# Altium schematic sheet MK66F.SchDoc
size A3
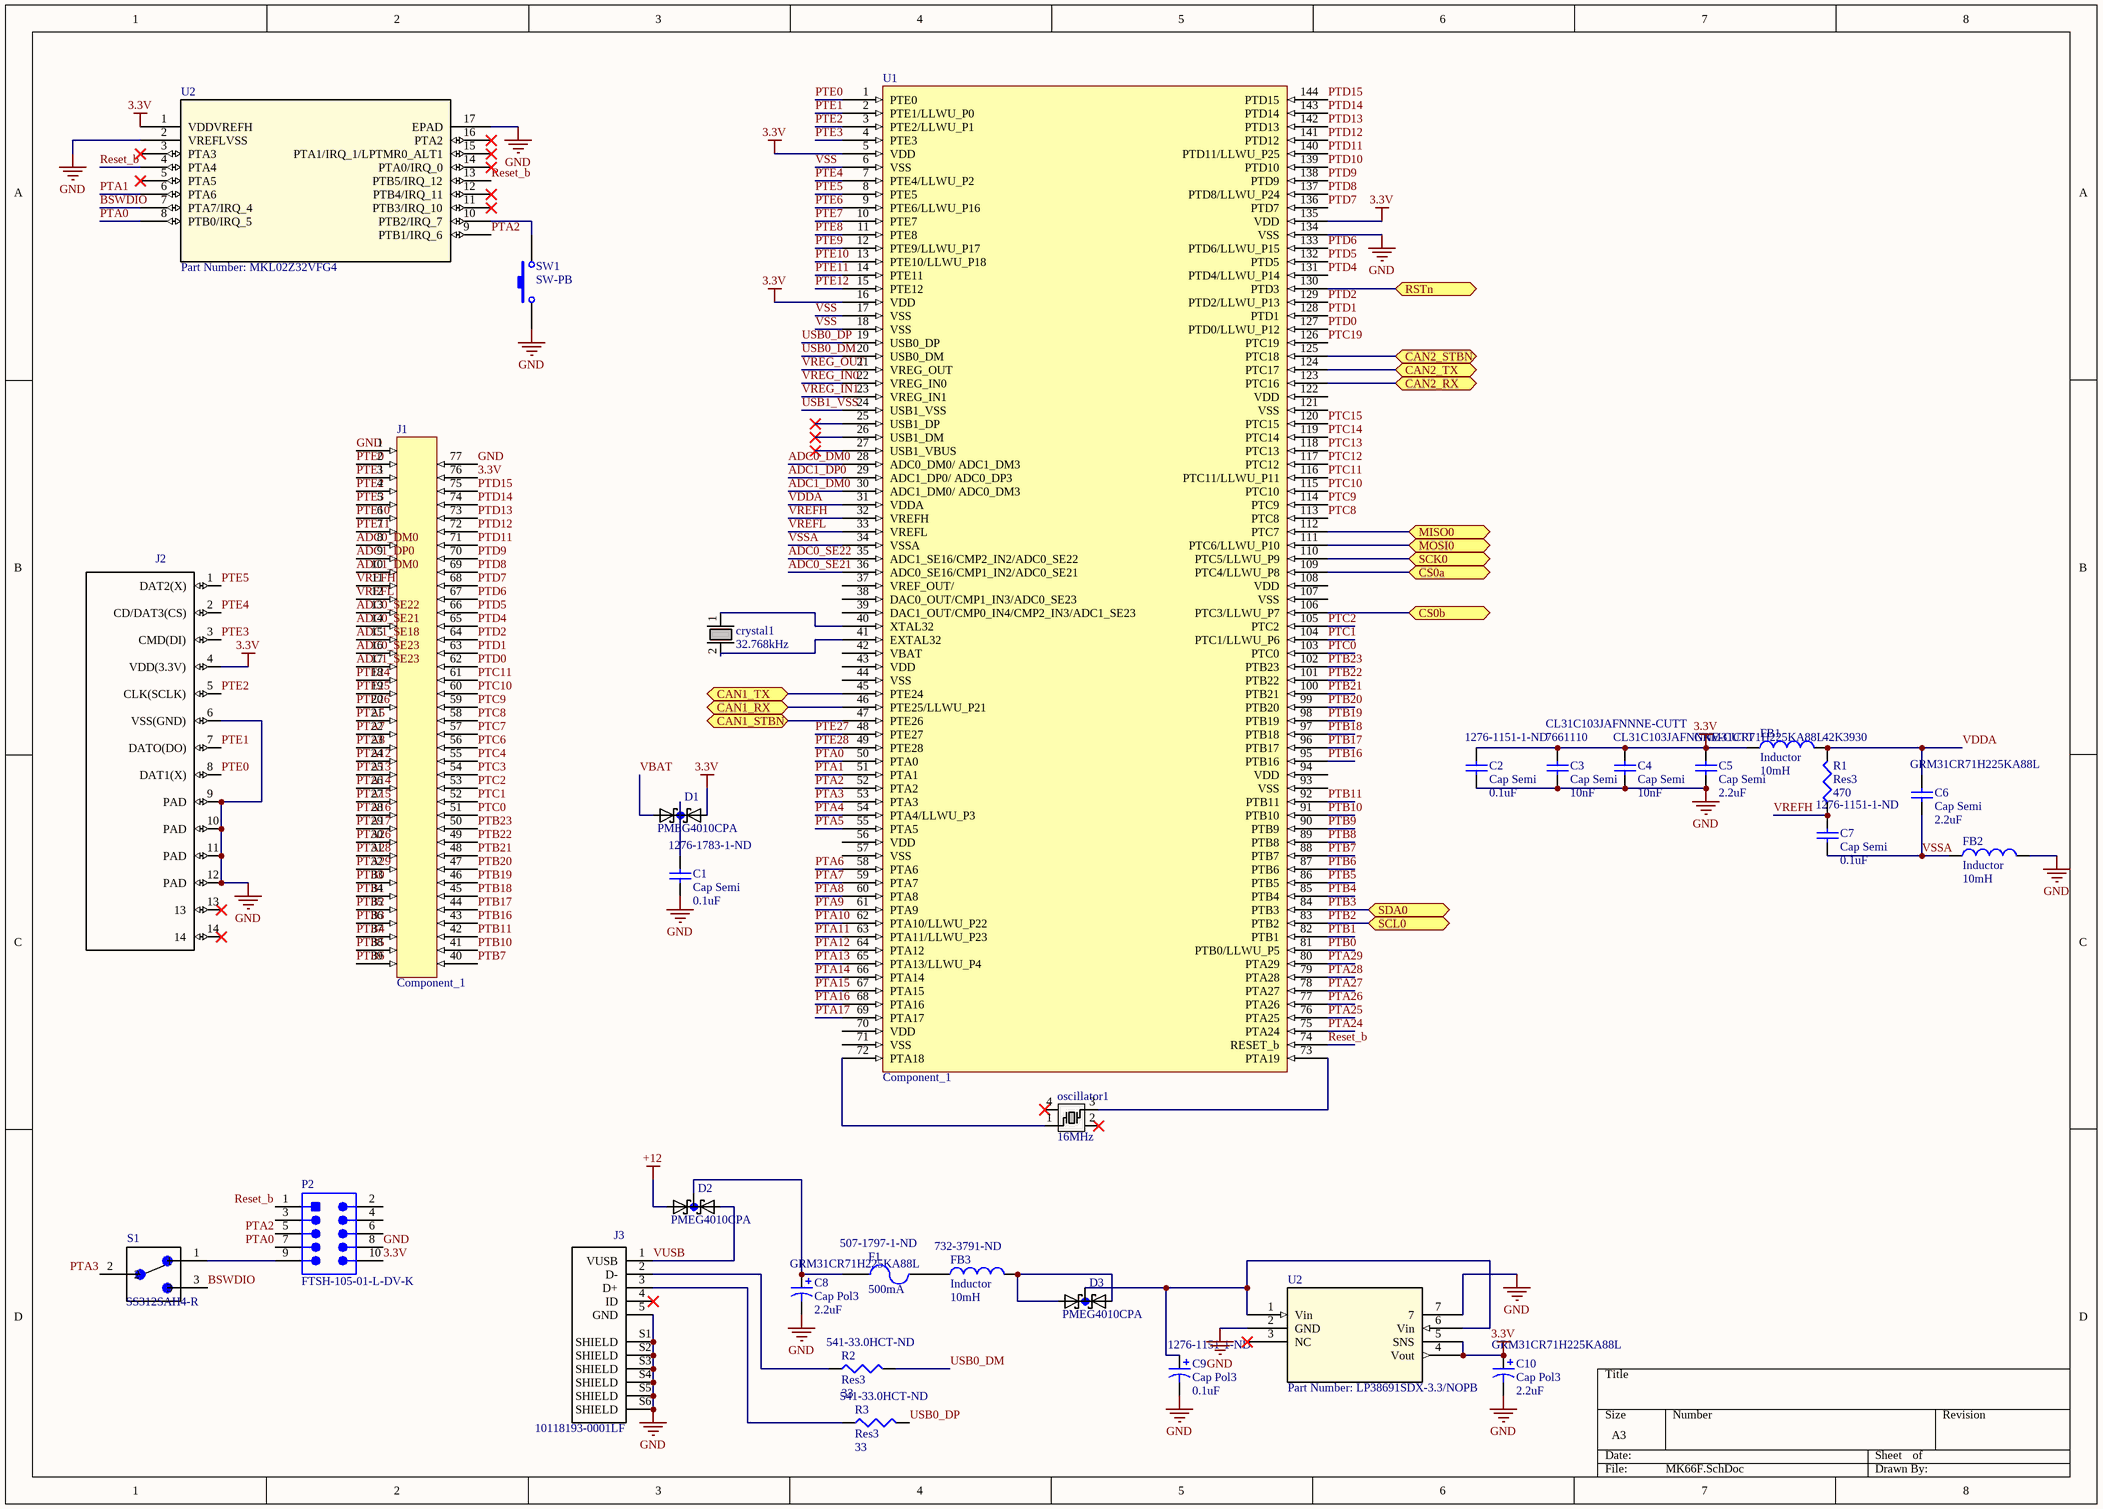
[diagram p0: MK66F.SchDoc]

## Parts
(Parts that share a designator on the sheet are numbered #1, #2 ... from top to bottom, then left to right.)
C1  Cap Semi  value 0.1uF  Supplier Part Number 1: 1276-1783-1-ND  [C1206]
C2  Cap Semi  value 0.1uF  Supplier Part Number 1: 1276-1151-1-ND  [C1206]
C3  Cap Semi  value 10nF  Supplier Part Number 1: 7661110  Supplier Part Number 2: CL31C103JAFNNNE-CUTT  [C1206]
C4  Cap Semi  value 10nF  Supplier Part Number 1: CL31C103JAFNNNE-CUTT  [C1206]
C5  Cap Semi  value 2.2uF  Supplier Part Number 1: GRM31CR71H225KA88L  [C1206]
C6  Cap Semi  value 2.2uF  Supplier Part Number 1: GRM31CR71H225KA88L  [C1206]
C7  Cap Semi  value 0.1uF  Supplier Part Number 1: 1276-1151-1-ND  [C1206]
C8  Cap Pol3  value 2.2uF  Supplier Part Number 1: GRM31CR71H225KA88L  [C1206]
C9  Cap Pol3  value 0.1uF  Supplier Part Number 1: 1276-1151-1-ND  [C1206]
C10  Cap Pol3  value 2.2uF  Supplier Part Number 1: GRM31CR71H225KA88L  [C1206]
crystal1  value 32.768kHz  [ECS-.327-CDX-1128]  (hidden comment: SMD_Crystal)
D1  PMEG4010CPA  [*SOT1061]
D2  PMEG4010CPA  [*SOT1061]
D3  PMEG4010CPA  [*SOT1061]
F1  500mA  Supplier Part Number 1: 507-1797-1-ND  [RESC3216X125N]
FB1  Inductor  value 10mH  [J1-0603]
FB2  Inductor  value 10mH  [J1-0603]
FB3  Inductor  value 10mH  Supplier Part Number 1: 732-3791-ND  [J1-0603]
J1  Component_1  [SPGA48x11 - duplicate]
J2  1140084168  [*1140084168]  (value not drawn)
J3  10118193-0001LF  [FCI_10118193-0001LF_10118193-0001LF(Primary)]
oscillator1  value 16MHz  [ECS-160-8-30B-CKM]  (hidden comment: SMD_oscillator)
P2  FTSH-105-01-L-DV-K  [SMTC-FTSH-105-01-L-DV-K_V]
R1  Res3  value 470  Supplier Part Number 1: 42K3930  [J1-0603]
R2  Res3  value 33  Supplier Part Number 1: 541-33.0HCT-ND  [J1-0603]
R3  Res3  value 33  Supplier Part Number 1: 541-33.0HCT-ND  [J1-0603]
S1  SS312SAH4-R  [*SW_SS312SAH4-R]
SW1  SW-PB  [P13348SCT-ND]
U1  Component_1  [98ASS23177W]
U2#1  Part Number: MKL02Z32VFG4  [QFN-16_3X3X0.65]
U2#2  Part Number: LP38691SDX-3.3/NOPB  [SDE06A]

## Ports
CAN1_RX (bidir), CAN1_STBN (bidir), CAN1_TX (bidir), CAN2_RX (bidir), CAN2_STBN (bidir), CAN2_TX (bidir), CS0a (bidir), CS0b (bidir), MISO0 (bidir), MOSI0 (bidir), RSTn (bidir), SCK0 (bidir), SCL0 (bidir), SDA0 (bidir)

## Nets
3.3V: C2.2 C3.2 C4.2 C5.2 C10.1 D1.2(A2) FB1.1 J1.76 J2.4(VDD(3.3V)) P2.10 U1.5(VDD) U1.16(VDD) U1.135(VDD) U2#1.1(VDDVREFH) U2#2.4(Vout) U2#2.5(SNS)
+12: D2.1(A1)
GND: C1.1 C2.1 C3.1 C4.1 C5.1 C8.2 C9.2 C10.2 FB2.2 J1.1 J1.77 J2.6(VSS(GND)) J2.9(PAD) J2.10(PAD) J2.11(PAD) J2.12(PAD) J3.5(GND) J3.S1(SHIELD) J3.S2(SHIELD) J3.S3(SHIELD) J3.S4(SHIELD) J3.S5(SHIELD) J3.S6(SHIELD) P2.8 SW1.1 U1.134(VSS) U2#1.2(VREFLVSS) U2#1.17(EPAD) U2#2.2(GND) U2#2.7
ADC0_DM0: J1.8 U1.28(ADC0_DM0/_ADC1_DM3)
ADC0_SE21: J1.14 U1.36(ADC0_SE16/CMP1_IN2/ADC0_SE21)
ADC0_SE22: J1.13 U1.35(ADC1_SE16/CMP2_IN2/ADC0_SE22)
ADC0_SE23: J1.16
ADC1_DM0: J1.10 U1.30(ADC1_DM0/_ADC0_DM3)
ADC1_DP0: J1.9 U1.29(ADC1_DP0/_ADC0_DP3)
ADC1_SE18: J1.15
ADC1_SE23: J1.17
BSWDIO: S1.3 U2#1.7(PTA7/IRQ_4)
CAN1_RX: U1.46(PTE25/LLWU_P21) ; port CAN1_RX
CAN1_STBN: U1.47(PTE26) ; port CAN1_STBN
CAN1_TX: U1.45(PTE24) ; port CAN1_TX
CAN2_RX: U1.123(PTC16) ; port CAN2_RX
CAN2_STBN: U1.125(PTC18) ; port CAN2_STBN
CAN2_TX: U1.124(PTC17) ; port CAN2_TX
CS0a: U1.109(PTC4/LLWU_P8) ; port CS0a
CS0b: U1.106(PTC3/LLWU_P7) ; port CS0b
MISO0: U1.112(PTC7) ; port MISO0
MOSI0: U1.111(PTC6/LLWU_P10) ; port MOSI0
PTA0: P2.7 U1.50(PTA0) U2#1.8(PTB0/IRQ_5)
PTA1: U1.51(PTA1) U2#1.6(PTA6)
PTA2: P2.5 U1.52(PTA2) U2#1.9(PTB1/IRQ_6)
PTA3: S1.2 U1.53(PTA3)
PTA4: U1.54(PTA4/LLWU_P3)
PTA5: J1.21 U1.55(PTA5)
PTA6: U1.58(PTA6)
PTA7: J1.22 U1.59(PTA7)
PTA8: J1.23 U1.60(PTA8)
PTA9: U1.61(PTA9)
PTA10: U1.62(PTA10/LLWU_P22)
PTA11: U1.63(PTA11/LLWU_P23)
PTA12: J1.24 U1.64(PTA12)
PTA13: J1.25 U1.65(PTA13/LLWU_P4)
PTA14: J1.26 U1.66(PTA14)
PTA15: J1.27 U1.67(PTA15)
PTA16: J1.28 U1.68(PTA16)
PTA17: J1.29 U1.69(PTA17)
PTA24: U1.75(PTA24)
PTA25: U1.76(PTA25)
PTA26: J1.30 U1.77(PTA26)
PTA27: U1.78(PTA27)
PTA28: J1.31 U1.79(PTA28)
PTA29: J1.32 U1.80(PTA29)
PTB0: J1.33 U1.81(PTB0/LLWU_P5)
PTB1: J1.34 U1.82(PTB1)
PTB2: J1.35 U1.83(PTB2) ; port SCL0
PTB3: J1.36 U1.84(PTB3) ; port SDA0
PTB4: J1.37 U1.85(PTB4)
PTB5: J1.38 U1.86(PTB5)
PTB6: J1.39 U1.87(PTB6)
PTB7: J1.40 U1.88(PTB7)
PTB8: U1.89(PTB8)
PTB9: U1.90(PTB9)
PTB10: J1.41 U1.91(PTB10)
PTB11: J1.42 U1.92(PTB11)
PTB16: J1.43 U1.95(PTB16)
PTB17: J1.44 U1.96(PTB17)
PTB18: J1.45 U1.97(PTB18)
PTB19: J1.46 U1.98(PTB19)
PTB20: J1.47 U1.99(PTB20)
PTB21: J1.48 U1.100(PTB21)
PTB22: J1.49 U1.101(PTB22)
PTB23: J1.50 U1.102(PTB23)
PTC0: J1.51 U1.103(PTC0)
PTC1: J1.52 U1.104(PTC1/LLWU_P6)
PTC2: J1.53 U1.105(PTC2)
PTC3: J1.54
PTC4: J1.55
PTC6: J1.56
PTC7: J1.57
PTC8: J1.58 U1.113(PTC8)
PTC9: J1.59 U1.114(PTC9)
PTC10: J1.60 U1.115(PTC10)
PTC11: J1.61 U1.116(PTC11/LLWU_P11)
PTC12: U1.117(PTC12)
PTC13: U1.118(PTC13)
PTC14: U1.119(PTC14)
PTC15: U1.120(PTC15)
PTC19: U1.126(PTC19)
PTD0: J1.62 U1.127(PTD0/LLWU_P12)
PTD1: J1.63 U1.128(PTD1)
PTD2: J1.64 U1.129(PTD2/LLWU_P13)
PTD4: J1.65 U1.131(PTD4/LLWU_P14)
PTD5: J1.66 U1.132(PTD5)
PTD6: J1.67 U1.133(PTD6/LLWU_P15)
PTD7: J1.68 U1.136(PTD7)
PTD8: J1.69 U1.137(PTD8/LLWU_P24)
PTD9: J1.70 U1.138(PTD9)
PTD10: U1.139(PTD10)
PTD11: J1.71 U1.140(PTD11/LLWU_P25)
PTD12: J1.72 U1.141(PTD12)
PTD13: J1.73 U1.142(PTD13)
PTD14: J1.74 U1.143(PTD14)
PTD15: J1.75 U1.144(PTD15)
PTE0: J1.2 J2.8(DAT1(X)) U1.1(PTE0)
PTE1: J1.3 J2.7(DATO(DO)) U1.2(PTE1/LLWU_P0)
PTE2: J1.4 J2.5(CLK(SCLK)) U1.3(PTE2/LLWU_P1)
PTE3: J1.5 J2.3(CMD(DI)) U1.4(PTE3)
PTE4: J2.2(CD/DAT3(CS)) U1.7(PTE4/LLWU_P2)
PTE5: J2.1(DAT2(X)) U1.8(PTE5)
PTE6: U1.9(PTE6/LLWU_P16)
PTE7: U1.10(PTE7)
PTE8: U1.11(PTE8)
PTE9: U1.12(PTE9/LLWU_P17)
PTE10: J1.6 U1.13(PTE10/LLWU_P18)
PTE11: J1.7 U1.14(PTE11)
PTE12: U1.15(PTE12)
PTE24: J1.18
PTE25: J1.19
PTE26: J1.20
PTE27: U1.48(PTE27)
PTE28: U1.49(PTE28)
Reset_b: P2.1 U1.74(RESET_b) U2#1.4(PTA4) U2#1.13(PTB5/IRQ_12)
RSTn: U1.130(PTD3) ; port RSTn
SCK0: U1.110(PTC5/LLWU_P9) ; port SCK0
USB0_DM: R2.2 U1.20(USB0_DM)
USB0_DP: R3.2 U1.19(USB0_DP)
USB1_VSS: U1.24(USB1_VSS)
VBAT: D1.1(A1)
VDDA: C6.2 FB1.2 R1.2 U1.31(VDDA)
VREFH: C7.2 J1.11 R1.1 U1.32(VREFH)
VREFL: J1.12 U1.33(VREFL)
VREG_IN0: U1.22(VREG_IN0)
VREG_IN1: U1.23(VREG_IN1)
VREG_OUT: U1.21(VREG_OUT)
VSS: U1.6(VSS) U1.17(VSS) U1.18(VSS)
VSSA: C6.1 C7.1 FB2.1 U1.34(VSSA)
VUSB: D2.2(A2) J3.1(VUSB)
NetC1_2: C1.2 D1.3(K1K2)
NetC8_1: C8.1 D2.3(K1K2) F1.1
NetC9_1: C9.1 D3.3(K1K2) U2#2.1(Vin) U2#2.6(Vin)
Netcrystal1_1: crystal1.1 U1.40(XTAL32)
Netcrystal1_2: crystal1.2 U1.41(EXTAL32)
NetD3_1: D3.1(A1) D3.2(A2) FB3.2
NetF1_2: F1.2 FB3.1
NetJ3_2: J3.2(D-) R2.1
NetJ3_3: J3.3(D+) R3.1
Netoscillator1_1: oscillator1.1 U1.72(PTA18)
Netoscillator1_3: oscillator1.3 U1.73(PTA19)
NetP2_9: P2.9 S1.1
NetSW1_2: SW1.2 U2#1.10(PTB2/IRQ_7)

Not connected (* = marked no-connect by the designer): J2 13* 14*; J3 4(ID)*; oscillator1 2* 4*; P2 2 3 4 6; U1 25(USB1_DP)* 26(USB1_DM)* 27(USB1_VBUS)* 37(VREF_OUT/) 38(DAC0_OUT/CMP1_IN3/ADC0_SE23) 39(DAC1_OUT/CMP0_IN4/CMP2_IN3/ADC1_SE23) 42(VBAT) 43(VDD) 44(VSS) 56(VDD) 57(VSS) 70(VDD) 71(VSS) 93(VSS) 94(VDD) 107(VSS) 108(VDD) 121(VSS) 122(VDD); U2#1 3(PTA3)* 5(PTA5)* 11(PTB3/IRQ_10)* 12(PTB4/IRQ_11)* 14(PTA0/IRQ_0)* 15(PTA1/IRQ_1/LPTMR0_ALT1)* 16(PTA2)*; U2#2 3(NC)*

## Library data of the parts
C1 = Cap Semi: SAMSUNG ELECTRO-MECHANICS - CL31B105KOFNNNE - SMD Multilayer Ceramic Capacitor, 1 µF, 16 V, 1206 [3216 Metric], ± 10%, X7R, CL Series; SPN: 1276-1017-1-ND; Capacitance: 1uF; Voltage Rating: 16V; Published: 8-Jun-2000; LatestRevisionDate: 29-May-2009; LatestRevisionNote: IPC-7351 Footprint Added.; PackageReference: C1206; Publisher: Altium Limited; PackageDescription: Chip Capacitor; Supplier 1: Digi-Key; Manufacturer: Samsung; Manufacturer Part Number: CL31B105KOFNNNE; RoHS: Yes; Category: Ceramic Capacitors; Stock 1: 71092; Pricing 1: 1=0.16000, 10=0.11100, 50=0.06320, 100=0.05230, 500=0.03668, 1000=0.03036 (USD); Mount: Surface Mount; Case/Package: 1206; Case Code (Metric): 3216; Case Code (Imperial): 1206; Contact Plating: Tin; Material: Ceramic; Min Operating Temperature: -55°C; Max Operating Temperature: 125°C; Tolerance: 10%; Packaging: Tape and Reel; Package Quantity: 1; Dielectric: X7R; Voltage Rating (DC): 16V; Voltage: 16V; Length: 3.2mm; Height: 1.25mm; Depth: 1.6mm; Width: 0.063inch; Thickness: 0.055inch; Radiation Hardening: No; Lead Free: Lead Free; ComponentLink1URL: https://datasheet.ciiva.com/25798/cl31b105kofnnne-25798673.pdf?src-supplier=Digi-Key; ComponentLink1Description: https://datasheet.ciiva.com/25798/cl31b105kofnnne-25798673.pdf?src-supplier=Digi-Key; ComponentLink2URL: https://datasheet.ciiva.com/26838/getdatasheetpartid-358370-26838906.pdf?src-supplier=Verical; ComponentLink2Description: https://datasheet.ciiva.com/26838/getdatasheetpartid-358370-26838906.pdf?src-supplier=Verical; ComponentLink3URL: https://datasheet.ciiva.com/29200/453334-da-01-en-vs-kondensator-1206-29200316.pdf?src-supplier=Conrad; ComponentLink3Description: https://datasheet.ciiva.com/29200/453334-da-01-en-vs-kondensator-1206-29200316.pdf?src-supplier=Conrad; ComponentLink4URL: https://datasheet.ciiva.com/26310/mlcc-catalogdownload2013-eng-26310089.pdf?src-supplier=Distrelec; ComponentLink4Description: https://datasheet.ciiva.com/26310/mlcc-catalogdownload2013-eng-26310089.pdf?src-supplier=Distrelec
C2 C7 = Cap Semi: CAP CER 0.1UF 100V X7R 1206; Manufacturer: Samsung; Manufacturer Part Number: CL31B104KCFNNNE; SPN: 1276-1017-1-ND; Material: Ceramic; Tolerance: 10%; Capacitance: 100nF; Published: 8-Jun-2000; LatestRevisionDate: 29-May-2009; LatestRevisionNote: IPC-7351 Footprint Added.; PackageReference: C1206; Publisher: Altium Limited; PackageDescription: Chip Capacitor; Supplier 1: Digi-Key; RoHS: Yes; Category: Ceramic Capacitors; Stock 1: 57431; Pricing 1: 1=0.14000, 10=0.09900, 50=0.05600, 100=0.04650, 500=0.03258, 1000=0.02697 (USD); Mount: Surface Mount; Case/Package: 1206; Case Code (Metric): 3216; Case Code (Imperial): 1206; Contact Plating: Tin; Min Operating Temperature: -55°C; Max Operating Temperature: 125°C; Packaging: Tape and Reel; Dielectric: X7R; Voltage Rating: 100V; Package Quantity: 1; Voltage Rating (DC): 100V; Voltage: 100V; Length: 3.2mm; Height: 1.25mm; Width: 0.063inch; Depth: 1.6mm; Thickness: 0.055inch; Radiation Hardening: No; Lead Free: Lead Free; ComponentLink1URL: https://datasheet.ciiva.com/16199/cl31b104kcfnnne-16199426.pdf?src-supplier=Future+Electronics; ComponentLink1Description: https://datasheet.ciiva.com/16199/cl31b104kcfnnne-16199426.pdf?src-supplier=Future+Electronics; ComponentLink2URL: https://datasheet.ciiva.com/25794/cl31b104kcfnnne-25794789.pdf?src-supplier=Digi-Key; ComponentLink2Description: https://datasheet.ciiva.com/25794/cl31b104kcfnnne-25794789.pdf?src-supplier=Digi-Key; ComponentLink3URL: https://datasheet.ciiva.com/26838/getdatasheetpartid-358426-26838891.pdf?src-supplier=Verical; ComponentLink3Description: https://datasheet.ciiva.com/26838/getdatasheetpartid-358426-26838891.pdf?src-supplier=Verical; ComponentLink4URL: https://datasheet.ciiva.com/29201/451915-da-01-en-vs-kondensator-1206-29201844.pdf?src-supplier=Conrad; ComponentLink4Description: https://datasheet.ciiva.com/29201/451915-da-01-en-vs-kondensator-1206-29201844.pdf?src-supplier=Conrad; ComponentLink5URL: https://datasheet.ciiva.com/26310/mlcc-catalogdownload2013-eng-26310106.pdf?src-supplier=Distrelec; ComponentLink5Description: https://datasheet.ciiva.com/26310/mlcc-catalogdownload2013-eng-26310106.pdf?src-supplier=Distrelec
C3 = Cap Semi: CL31 Series 1206 0.01 uF 25 V 5 % COG SMT Multilayer Ceramic Capacitor; Manufacturer: Samsung; Manufacturer Part Number: CL31C102FBCNNNL; SPN: 1276-2735-1-ND; Description: Cap Ceramic 0.001uF 50V C0G 1% SMD 1206 125C Cardboard T/R; Tolerance: 1%; Capacitance: 1nF; Voltage Rating: 50V; Dielectric: C0G; Temperature Coefficient: 300ppm/°C; Published: 8-Jun-2000; LatestRevisionDate: 29-May-2009; LatestRevisionNote: IPC-7351 Footprint Added.; PackageReference: C1206; Publisher: Altium Limited; PackageDescription: Chip Capacitor; Supplier 1: RSComponents; RoHS: Yes; Category: Ceramic Capacitors; Stock 1: 100; Pricing 1: 50=0.15100, 250=0.13600, 500=0.12700, 2500=0.12000, 5000=0.11400 (USD); Mount: Surface Mount; Case/Package: 1206; Min Operating Temperature: -55°C; Max Operating Temperature: 125°C; Packaging: Tape and Reel; Voltage Rating (DC): 50V; Package Quantity: 15000; Voltage: 50V; Length: 3.2mm; Height: 0.85mm; Width: 0.063inch; Thickness: 0.039inch; Depth: 1.6mm; Radiation Hardening: No; ComponentLink1URL: https://datasheet.ciiva.com/25728/cl31c102fbcnnnl-25728280.pdf?src-supplier=Digi-Key; ComponentLink1Description: https://datasheet.ciiva.com/25728/cl31c102fbcnnnl-25728280.pdf?src-supplier=Digi-Key; Supplier 2: Future Electronics; Stock 2: 42000; Pricing 2: 1=0.09150, 50=0.06980, 100=0.06650, 250=0.06240, 500=0.05950 (USD); Case Code (Imperial): 1206; Case Code (Metric): 3216; Lead Free: Lead Free; ComponentLink2URL: https://datasheet.ciiva.com/15196/getdatasheetpartid-355227-15196083.pdf?src-supplier=Verical; ComponentLink2Description: https://datasheet.ciiva.com/15196/getdatasheetpartid-355227-15196083.pdf?src-supplier=Verical; ComponentLink3URL: https://datasheet.ciiva.com/16426/cl31c103jafnnne-16426415.pdf?src-supplier=Future+Electronics; ComponentLink3Description: https://datasheet.ciiva.com/16426/cl31c103jafnnne-16426415.pdf?src-supplier=Future+Electronics
C4 = Cap Semi: CL31 Series 1206 0.01 uF 25 V 5 % COG SMT Multilayer Ceramic Capacitor; Manufacturer: Samsung; Manufacturer Part Number: CL31C103JAFNNNE; SPN: 1276-2735-1-ND; Tolerance: 5%; Voltage Rating: 25V; Dielectric: C0G; Temperature Coefficient: 300ppm/°C; Published: 8-Jun-2000; LatestRevisionDate: 29-May-2009; LatestRevisionNote: IPC-7351 Footprint Added.; PackageReference: C1206; Publisher: Altium Limited; PackageDescription: Chip Capacitor; Supplier 1: Future Electronics; RoHS: Yes; Category: Ceramic Capacitors; Stock 1: 42000; Pricing 1: 1=0.09150, 50=0.06980, 100=0.06650, 250=0.06240, 500=0.05950 (USD); Mount: Surface Mount; Case/Package: 1206; Case Code (Imperial): 1206; Case Code (Metric): 3216; Min Operating Temperature: -55°C; Max Operating Temperature: 125°C; Packaging: Tape and Reel; Capacitance: 10nF; Package Quantity: 1; Voltage Rating (DC): 25V; Voltage: 25V; Length: 3.2mm; Height: 1.25mm; Width: 0.063inch; Depth: 1.6mm; Thickness: 0.055inch; Radiation Hardening: No; Lead Free: Lead Free; ComponentLink1URL: https://datasheet.ciiva.com/15196/getdatasheetpartid-355227-15196083.pdf?src-supplier=Verical; ComponentLink1Description: https://datasheet.ciiva.com/15196/getdatasheetpartid-355227-15196083.pdf?src-supplier=Verical; ComponentLink2URL: https://datasheet.ciiva.com/16426/cl31c103jafnnne-16426415.pdf?src-supplier=Future+Electronics; ComponentLink2Description: https://datasheet.ciiva.com/16426/cl31c103jafnnne-16426415.pdf?src-supplier=Future+Electronics
C5 C6 = Cap Semi: MURATA         GRM31CR71H225KA88L.             SMD Multilayer Ceramic Capacitor, 1206 [3216 Metric], 2.2 F, 50 V,  10%, X7R; SPN: 311-3513-1-ND; Voltage Rating: 50V; Published: 8-Jun-2000; LatestRevisionDate: 29-May-2009; LatestRevisionNote: IPC-7351 Footprint Added.; PackageReference: C1206; Publisher: Altium Limited; PackageDescription: Chip Capacitor; Supplier 1: Arrow Electronics; Manufacturer: Murata; Manufacturer Part Number: GRM31CR71H225KA88L; RoHS: Yes; Category: Ceramic Capacitors; Stock 1: 86000; Pricing 1: 2000=0.20570, 4000=0.18180, 10000=0.16710, 50000=0.15370 (USD); Mount: Surface Mount; Case/Package: 1206; Case Code (Metric): 3216; Case Code (Imperial): 1206; Material: Ceramic; Min Operating Temperature: -55°C; Max Operating Temperature: 125°C; Tolerance: 10%; Capacitance: 2.2uF; Packaging: Tape and Reel; Dielectric: X7R; Voltage Rating (DC): 50V; Termination: SMD/SMT; Package Quantity: 1; Voltage: 50V; Length: 3.2mm; Height: 1.6mm; Width: 0.063inch; Depth: 1.6mm; Thickness: 0.071inch; Lead Free: Lead Free; REACH SVHC: No SVHC; ComponentLink1URL: https://datasheet.ciiva.com/3776/345grm31cr71h225ka8823-3776981.pdf?src-supplier=Arrow+Electronics; ComponentLink1Description: https://datasheet.ciiva.com/3776/345grm31cr71h225ka8823-3776981.pdf?src-supplier=Arrow+Electronics; ComponentLink2URL: https://datasheet.ciiva.com/7937/1697713-7937747.pdf?src-supplier=Element14; ComponentLink2Description: https://datasheet.ciiva.com/7937/1697713-7937747.pdf?src-supplier=Element14; ComponentLink3URL: https://datasheet.ciiva.com/34302/1859503-34302884.pdf?src-supplier=Jameco; ComponentLink3Description: https://datasheet.ciiva.com/34302/1859503-34302884.pdf?src-supplier=Jameco; ComponentLink4URL: https://datasheet.ciiva.com/138/grm31cr71h225ka88-01-138838.pdf?src-supplier=Digi-Key; ComponentLink4Description: https://datasheet.ciiva.com/138/grm31cr71h225ka88-01-138838.pdf?src-supplier=Digi-Key; ComponentLink5URL: https://datasheet.ciiva.com/11789/0900766b80ef921d-11789113.pdf?src-supplier=RSComponents; ComponentLink5Description: https://datasheet.ciiva.com/11789/0900766b80ef921d-11789113.pdf?src-supplier=RSComponents; ComponentLink6URL: https://datasheet.ciiva.com/29199/454960-da-01-en-vs-kondensator-1206-29199432.pdf?src-supplier=Conrad; ComponentLink6Description: https://datasheet.ciiva.com/29199/454960-da-01-en-vs-kondensator-1206-29199432.pdf?src-supplier=Conrad; ComponentLink7URL: https://datasheet.ciiva.com/29202/450955-da-01-de-vs-chip-kond-1206-2-2-uf-10pr-50-0v-x7r-29202570.pdf?src-supplier=Conrad; ComponentLink7Description: https://datasheet.ciiva.com/29202/450955-da-01-de-vs-chip-kond-1206-2-2-uf-10pr-50-0v-x7r-29202570.pdf?src-supplier=Conrad; ComponentLink8URL: https://datasheet.ciiva.com/138/grm31cr71h225ka88-01-138836.pdf?src-supplier=Digi-Key; ComponentLink8Description: https://datasheet.ciiva.com/138/grm31cr71h225ka88-01-138836.pdf?src-supplier=Digi-Key; ComponentLink9URL: https://datasheet.ciiva.com/138/grm31cr71h225ka88-01-138837.pdf?src-supplier=Digi-Key; ComponentLink9Description: https://datasheet.ciiva.com/138/grm31cr71h225ka88-01-138837.pdf?src-supplier=Digi-Key; ComponentLink10URL: https://datasheet.ciiva.com/14116/nmgrm-data-en-14116713.pdf?src-supplier=Distrelec; ComponentLink10Description: https://datasheet.ciiva.com/14116/nmgrm-data-en-14116713.pdf?src-supplier=Distrelec; ComponentLink11URL: https://datasheet.ciiva.com/16353/c02e-16353338.pdf?src-supplier=Future+Electronics; ComponentLink11Description: https://datasheet.ciiva.com/16353/c02e-16353338.pdf?src-supplier=Future+Electronics
C8 C10 = Cap Pol3: MURATA         GRM31CR71H225KA88L.             SMD Multilayer Ceramic Capacitor, 1206 [3216 Metric], 2.2 F, 50 V,  10%, X7R; SPN: 311-3513-1-ND; Voltage Rating: 50V; Published: 8-Jun-2000; LatestRevisionDate: 29-May-2009; LatestRevisionNote: IPC-7351 Footprint Added.; PackageReference: C0805; Publisher: Altium Limited; PackageDescription: Chip Capacitor; Supplier 1: Arrow Electronics; Manufacturer: Murata; Manufacturer Part Number: GRM31CR71H225KA88L; RoHS: Yes; Category: Ceramic Capacitors; Stock 1: 86000; Pricing 1: 2000=0.20570, 4000=0.18180, 10000=0.16710, 50000=0.15370 (USD); Mount: Surface Mount; Case/Package: 1206; Case Code (Metric): 3216; Case Code (Imperial): 1206; Material: Ceramic; Min Operating Temperature: -55°C; Max Operating Temperature: 125°C; Tolerance: 10%; Capacitance: 2.2uF; Dielectric: X7R; Package Quantity: 1; Packaging: Tape and Reel; Voltage Rating (DC): 50V; Termination: SMD/SMT; Voltage: 50V; Length: 3.2mm; Height: 1.6mm; Width: 0.063inch; Thickness: 0.071inch; Depth: 1.6mm; REACH SVHC: No SVHC; Lead Free: Lead Free; ComponentLink1URL: https://datasheet.ciiva.com/3776/345grm31cr71h225ka8823-3776981.pdf?src-supplier=Arrow+Electronics; ComponentLink1Description: https://datasheet.ciiva.com/3776/345grm31cr71h225ka8823-3776981.pdf?src-supplier=Arrow+Electronics; ComponentLink2URL: https://datasheet.ciiva.com/7937/1697713-7937747.pdf?src-supplier=Element14; ComponentLink2Description: https://datasheet.ciiva.com/7937/1697713-7937747.pdf?src-supplier=Element14; ComponentLink3URL: https://datasheet.ciiva.com/34302/1859503-34302884.pdf?src-supplier=Jameco; ComponentLink3Description: https://datasheet.ciiva.com/34302/1859503-34302884.pdf?src-supplier=Jameco; ComponentLink4URL: https://datasheet.ciiva.com/138/grm31cr71h225ka88-01-138838.pdf?src-supplier=Digi-Key; ComponentLink4Description: https://datasheet.ciiva.com/138/grm31cr71h225ka88-01-138838.pdf?src-supplier=Digi-Key; ComponentLink5URL: https://datasheet.ciiva.com/11789/0900766b80ef921d-11789113.pdf?src-supplier=RSComponents; ComponentLink5Description: https://datasheet.ciiva.com/11789/0900766b80ef921d-11789113.pdf?src-supplier=RSComponents; ComponentLink6URL: https://datasheet.ciiva.com/29199/454960-da-01-en-vs-kondensator-1206-29199432.pdf?src-supplier=Conrad; ComponentLink6Description: https://datasheet.ciiva.com/29199/454960-da-01-en-vs-kondensator-1206-29199432.pdf?src-supplier=Conrad; ComponentLink7URL: https://datasheet.ciiva.com/29202/450955-da-01-de-vs-chip-kond-1206-2-2-uf-10pr-50-0v-x7r-29202570.pdf?src-supplier=Conrad; ComponentLink7Description: https://datasheet.ciiva.com/29202/450955-da-01-de-vs-chip-kond-1206-2-2-uf-10pr-50-0v-x7r-29202570.pdf?src-supplier=Conrad; ComponentLink8URL: https://datasheet.ciiva.com/138/grm31cr71h225ka88-01-138836.pdf?src-supplier=Digi-Key; ComponentLink8Description: https://datasheet.ciiva.com/138/grm31cr71h225ka88-01-138836.pdf?src-supplier=Digi-Key; ComponentLink9URL: https://datasheet.ciiva.com/138/grm31cr71h225ka88-01-138837.pdf?src-supplier=Digi-Key; ComponentLink9Description: https://datasheet.ciiva.com/138/grm31cr71h225ka88-01-138837.pdf?src-supplier=Digi-Key; ComponentLink10URL: https://datasheet.ciiva.com/14116/nmgrm-data-en-14116713.pdf?src-supplier=Distrelec; ComponentLink10Description: https://datasheet.ciiva.com/14116/nmgrm-data-en-14116713.pdf?src-supplier=Distrelec; ComponentLink11URL: https://datasheet.ciiva.com/16353/c02e-16353338.pdf?src-supplier=Future+Electronics; ComponentLink11Description: https://datasheet.ciiva.com/16353/c02e-16353338.pdf?src-supplier=Future+Electronics
C9 = Cap Pol3: CAP CER 0.1UF 100V X7R 1206; Manufacturer: Samsung; Manufacturer Part Number: CL31B104KCFNNNE; SPN: 1276-1017-1-ND; Material: Ceramic; Tolerance: 10%; Capacitance: 100nF; Published: 8-Jun-2000; LatestRevisionDate: 29-May-2009; LatestRevisionNote: IPC-7351 Footprint Added.; PackageReference: C0805; Publisher: Altium Limited; PackageDescription: Chip Capacitor; Supplier 1: Digi-Key; RoHS: Yes; Category: Ceramic Capacitors; Stock 1: 57431; Pricing 1: 1=0.14000, 10=0.09900, 50=0.05600, 100=0.04650, 500=0.03258, 1000=0.02697 (USD); Mount: Surface Mount; Case/Package: 1206; Case Code (Metric): 3216; Case Code (Imperial): 1206; Contact Plating: Tin; Min Operating Temperature: -55°C; Max Operating Temperature: 125°C; Dielectric: X7R; Voltage Rating: 100V; Package Quantity: 1; Packaging: Tape and Reel; Voltage Rating (DC): 100V; Voltage: 100V; Length: 3.2mm; Height: 1.25mm; Depth: 1.6mm; Thickness: 0.055inch; Width: 0.063inch; Radiation Hardening: No; Lead Free: Lead Free; ComponentLink1URL: https://datasheet.ciiva.com/16199/cl31b104kcfnnne-16199426.pdf?src-supplier=Future+Electronics; ComponentLink1Description: https://datasheet.ciiva.com/16199/cl31b104kcfnnne-16199426.pdf?src-supplier=Future+Electronics; ComponentLink2URL: https://datasheet.ciiva.com/25794/cl31b104kcfnnne-25794789.pdf?src-supplier=Digi-Key; ComponentLink2Description: https://datasheet.ciiva.com/25794/cl31b104kcfnnne-25794789.pdf?src-supplier=Digi-Key; ComponentLink3URL: https://datasheet.ciiva.com/26838/getdatasheetpartid-358426-26838891.pdf?src-supplier=Verical; ComponentLink3Description: https://datasheet.ciiva.com/26838/getdatasheetpartid-358426-26838891.pdf?src-supplier=Verical; ComponentLink4URL: https://datasheet.ciiva.com/29201/451915-da-01-en-vs-kondensator-1206-29201844.pdf?src-supplier=Conrad; ComponentLink4Description: https://datasheet.ciiva.com/29201/451915-da-01-en-vs-kondensator-1206-29201844.pdf?src-supplier=Conrad; ComponentLink5URL: https://datasheet.ciiva.com/26310/mlcc-catalogdownload2013-eng-26310106.pdf?src-supplier=Distrelec; ComponentLink5Description: https://datasheet.ciiva.com/26310/mlcc-catalogdownload2013-eng-26310106.pdf?src-supplier=Distrelec
crystal1 = ECS-.327-CDX-1128: SPN: XC2190CT-ND
D1-D3 = PMEG4010CPA: DIODE, DUAL, SCH, 40V, 1A, SOT1061; Diode Type: Schottky; Diode Configuration: Dual, Common Cathode; Repetitive Rever...; MF: Nexperia USA; SnapEDA_Link: https://www.snapeda.com/parts/PMEG4010CPA/Nexperia%20USA%20Inc./view-part/?ref=snap; MP: PMEG4010CPA; Package: PowerUDFN-3 Nexperia USA; Digi-Key_Purchase_URL: https://www.digikey.ca/product-detail/en/nexperia-usa-inc/PMEG4010CPASX/1727-2405-1-ND/5436151?utm_source=snapeda&utm_medium=aggregator&utm_campaign=symbol; Digi-Key_Part_Number: 1727-5212-1-ND; Value: *
F1 = Fuse 2: PTC Resettable Fuse 0.2A(hold) 0.4A(trip) 30VDC 10A 0.4W 0.1s 0.6Ohm SMD Solder Pad 3.5 X 1.8 X 0.75mm T/R; Manufacturer: Bel; Manufacturer Part Number: 0ZCJ0020FF2E; Trip Current: 400mA; Hold Current: 200mA; Max Voltage Rating (DC): 30V; Power Dissipation: 400mW; Approvals: UL,TUV; Published: 8-Jun-2000; LatestRevisionDate: 17-Jul-2002; LatestRevisionNote: Re-released for DXP Platform.; PackageReference: PIN-W2/E2.8; Publisher: Altium Limited; PackageDescription: Thru-Hole; 2 Leads; SPN: 507-1797-1-ND; Supplier 1: Digi-Key; RoHS: Yes; Category: PTC Resettable Fuses; Stock 1: 117616; Pricing 1: 1=0.12000, 5=0.12000, 10=0.11400, 50=0.10200, 100=0.09500, 250=0.08448, 500=0.07040, 1000=0.06688 (USD); Mount: Surface Mount; Case/Package: 1206; Case Code (Metric): 3216; Case Code (Imperial): 1206; Contact Plating: Tin,Matte; Number of Terminals: 2; Min Operating Temperature: -40°C; Max Operating Temperature: 85°C; Time to Trip: 0.1s; Max Current Rating: 10A; Package Quantity: 3000; Packaging: Cut Tape; Lead Free: Lead Free; ComponentLink1URL: https://datasheet.ciiva.com/18550/0zcj-18550613.pdf?src-supplier=Digi-Key; ComponentLink1Description: https://datasheet.ciiva.com/18550/0zcj-18550613.pdf?src-supplier=Digi-Key
FB1 FB2 = Inductor: Code_IEC: 1005; SPN: 490-1037-1-ND; Published: 8-Jun-2000; LatestRevisionDate: 29-May-2009; LatestRevisionNote: IPC-7351 Footprint Added.; PackageReference: 0402-A; Publisher: Altium Limited; PackageDescription: Chip Inductor; Code_JEITA: 0402
FB3 = Inductor: WURTH ELEKTRONIK         744772103             LINE CHOKE, 10000UH, 0.14A; Manufacturer: Wurth Electronics; Code_IEC: 1005; SPN: 490-1037-1-ND; Core Material: Ferrite; DC Resistance (DCR): 24R; Max DC Current: 140mA; Inductance Tolerance: 10%; Tolerance: 5%; Test Frequency: 1kHz; Shielding: Unshielded; Self Resonant Frequency: 430kHz; Saturation Current: 170mA; Published: 8-Jun-2000; LatestRevisionDate: 29-May-2009; LatestRevisionNote: IPC-7351 Footprint Added.; PackageReference: 0402-A; Publisher: Altium Limited; PackageDescription: Chip Inductor; Code_JEITA: 0402; Supplier 1: Digi-Key; Manufacturer Part Number: 744772103; RoHS: Yes; Category: Fixed Inductors; Stock 1: 69; Pricing 1: 1=0.96000, 10=0.90900, 50=0.84700, 140=0.75300, 280=0.69000 (USD); Mount: Through Hole; Case/Package: Radial; Number of Pins: 2; Min Operating Temperature: -40°C; Max Operating Temperature: 125°C; Inductance: 10mH; Packaging: Tray; Current Rating: 140mA; Package Quantity: 140; Termination: Radial; RMS Current (Irms): 140mA; Composition: Wirewound; Diameter: 7.8mm; Length: 9.5mm; Lead Pitch: 5mm; Height - Seated (Max): 0.394inch; REACH SVHC: Unknown; ComponentLink1URL: https://datasheet.ciiva.com/7265/744772103-7265352.pdf?src-supplier=Newark; ComponentLink1Description: https://datasheet.ciiva.com/7265/744772103-7265352.pdf?src-supplier=Newark; ComponentLink2URL: https://datasheet.ciiva.com/6693/744772103-6693469.pdf?src-supplier=Digi-Key; ComponentLink2Description: https://datasheet.ciiva.com/6693/744772103-6693469.pdf?src-supplier=Digi-Key; ComponentLink3URL: https://datasheet.ciiva.com/13278/744772103-59781-13278799.pdf?src-supplier=Mouser; ComponentLink3Description: https://datasheet.ciiva.com/13278/744772103-59781-13278799.pdf?src-supplier=Mouser; ComponentLink4URL: https://datasheet.ciiva.com/7695/1736350-7695879.pdf?src-supplier=Element14; ComponentLink4Description: https://datasheet.ciiva.com/7695/1736350-7695879.pdf?src-supplier=Element14
J2 = 1140084168: Conn; IC Socket; Micro SD; Right Angle; PCB Mount; MicroSD Ser.; MF: Amphenol ICC; Package: None; MP: 1140084168; SnapEDA_Link: https://www.snapeda.com/parts/1140084168/Amphenol%20ICC/view-part/?ref=snap; Digi-Key_Purchase_URL: https://www.digikey.ca/product-detail/en/amphenol-icc-commercial-products/114-00841-68/114-00841-68-1-ND/2187101?utm_source=snapeda&utm_medium=aggregator&utm_campaign=symbol; Digi-Key_Part_Number: 114-00841-68-1-ND; Value: *
J3 = 10118193-0001LF: Single Port 5 Contact Shielded SMT MICRO USB B-Type Receptacle; MF: Amphenol FCI; SnapEDA_Link: https://www.snapeda.com/parts/10118193-0001LF/Amphenol%20FCI/view-part/?ref=snap; Digi-Key_Purchase_URL: https://www.digikey.ca/product-detail/en/amphenol-fci/10118193-0001LF/609-4616-1-ND/2785380?utm_source=snapeda&utm_medium=aggregator&utm_campaign=symbol; Package: None; MP: 10118193-0001LF; Digi-Key_Part_Number: 609-4616-1-ND; Value: *
oscillator1 = ECS-160-8-30B-CKM: SPN: XC1839CT-ND
P2 = CMP-2000-05353-1: Male Header, Pitch 1.27 mm, 2 x 5 Position, Height 6.25 mm; Manufacturer: Samtec; Pitch: 0.050"(1.27mm); Other Names: Q3937619; Number of Positions: 10; Mating Products: SFMC-105-L2-S-D-TR-ND / -CONN.05"SURFACE10POSSMT / FLE-105-01-G-DV-TR-ND / -CONNSKT1.27MM10POSDUALSMD / FLE-105-01-G-DV-A-P-ND / -CONNSKT1.27MM10POSDUALSMD / FLE-105-01-G-DV-A-ND / -CONNSKT1.27MM10POSDUALSMD / CLP-105-02-G-D-P-TR-ND / -CONNRCPT10POSDUAL.05"SMD / SAM1155-05-ND / -CONNRCPT10POSDUAL.05"SMD / SAM1154-05-ND / -CONNRCPT10POSDUAL.05"SMD / SAM1153-05-ND / -CONNRCPT10POSDUAL.05"SMD / SAM1226-05-ND / -CONNRCPT.05"10POSDUALSMD; Number of Positions Loaded: All; Connector Type: Header,Unshrouded; Product Training Modules: Board-to-BoardConnectors; Datasheet Version: Rev. ET, 10/1995; Number of Rows: 2; Standard Package: 1; Package Description: Male Header, Pitch 1.27 mm, 2 x 5 Position, Height 5.97 mm, Tail Length 4.32 mm; Contact Finish Thickness: 10µin(0.25µm); Series: FTSH; Termination: Solder; Contact Type: MalePin; Color: Black; Package Reference: FTSH-105-01-L-DV-K; Family: RectangularConnectors-Headers,MalePins; Package URL: http://suddendocs.samtec.com/prints/ftsh-1xx-xx-xxx-dv-xxx-footprint.pdf; Packaging: Tube; Mounting Type: SurfaceMount; Category: Connectors,Interconnects; Datasheet URL: http://suddendocs.samtec.com/prints/ftsh-1xx-xx-xxx-dv-xxx-mkt.pdf; Row Spacing: 0.050"(1.27mm); Manufacturer URL: http://www.samtec.com/; Contact Mating Length: 0.120"(3.05mm); Contact Finish: Gold
R1 = Res3: SMD Resistor, Thick film 470 Ohm,  ±  1 %, 0603, CRCW0603470RFKEA, Vishay; Manufacturer Part Number: CRCW0603-470RFKEA; SPN: RHM470ADCT-ND; Resistance: 470R; Tolerance: 1%; Temperature Coefficient: 100ppm/°C; Power Rating: 100mW; Voltage Rating: 75V; Published: 8-Jun-2000; LatestRevisionDate: 29-May-2009; LatestRevisionNote: IPC-7351 Footprint Added.; PackageReference: J1-0603; Publisher: Altium Limited; PackageDescription: Chip Resistor; Supplier 1: Newark; Manufacturer: Vishay; RoHS: Yes; Category: Chip SMD Resistors; Mount: Surface Mount; Case/Package: 0603; Weight: 7.1E-05oz; Case Code (Metric): 1608; Case Code (Imperial): 0603; Contact Plating: Tin,Lead; Min Operating Temperature: -55°C; Max Operating Temperature: 155°C; Composition: Thick Film; Packaging: Tape and Reel; Number of Terminations: 2; Max Power Dissipation: 100mW; Voltage Rating (DC): 75V; Package Quantity: 10; Termination: SMD/SMT; Military Standard: Not; Features: Automotive AEC-Q200; Length: 1.55mm; Height: 0.45mm; Width: 0.033inch; Depth: 0.85mm; Radiation Hardening: No; Lead Free: Lead Free; REACH SVHC: Unknown; ComponentLink1URL: https://datasheet.ciiva.com/11808/0900766b80d98afc-11808677.pdf?src-supplier=RSComponents; ComponentLink1Description: https://datasheet.ciiva.com/11808/0900766b80d98afc-11808677.pdf?src-supplier=RSComponents; ComponentLink2URL: https://datasheet.ciiva.com/7777/1720486-7777560.pdf?src-supplier=Element14; ComponentLink2Description: https://datasheet.ciiva.com/7777/1720486-7777560.pdf?src-supplier=Element14; ComponentLink3URL: https://datasheet.ciiva.com/7777/1720486-7777561.pdf?src-supplier=Element14; ComponentLink3Description: https://datasheet.ciiva.com/7777/1720486-7777561.pdf?src-supplier=Element14; ComponentLink4URL: https://datasheet.ciiva.com/2465/dcrcwe3-2465555.pdf?src-supplier=Digi-Key; ComponentLink4Description: https://datasheet.ciiva.com/2465/dcrcwe3-2465555.pdf?src-supplier=Digi-Key; ComponentLink5URL: https://datasheet.ciiva.com/2465/dcrcwe3-2465556.pdf?src-supplier=Digi-Key; ComponentLink5Description: https://datasheet.ciiva.com/2465/dcrcwe3-2465556.pdf?src-supplier=Digi-Key; ComponentLink6URL: https://datasheet.ciiva.com/2465/dcrcwe3-2465557.pdf?src-supplier=Digi-Key; ComponentLink6Description: https://datasheet.ciiva.com/2465/dcrcwe3-2465557.pdf?src-supplier=Digi-Key; ComponentLink7URL: https://datasheet.ciiva.com/15159/getdatasheetpartid-45798-15159558.pdf?src-supplier=Verical; ComponentLink7Description: https://datasheet.ciiva.com/15159/getdatasheetpartid-45798-15159558.pdf?src-supplier=Verical; ComponentLink8URL: https://datasheet.ciiva.com/3257/dcrcwe3-3257623.pdf?src-supplier=Avnet; ComponentLink8Description: https://datasheet.ciiva.com/3257/dcrcwe3-3257623.pdf?src-supplier=Avnet; ComponentLink9URL: https://datasheet.ciiva.com/3257/dcrcwe3-3257624.pdf?src-supplier=Avnet; ComponentLink9Description: https://datasheet.ciiva.com/3257/dcrcwe3-3257624.pdf?src-supplier=Avnet; ComponentLink10URL: https://datasheet.ciiva.com/5551/dcrcwe3-109170-5551784.pdf?src-supplier=Mouser; ComponentLink10Description: https://datasheet.ciiva.com/5551/dcrcwe3-109170-5551784.pdf?src-supplier=Mouser; ComponentLink11URL: https://datasheet.ciiva.com/7777/1697337-7777322.pdf?src-supplier=Element14; ComponentLink11Description: https://datasheet.ciiva.com/7777/1697337-7777322.pdf?src-supplier=Element14; ComponentLink12URL: https://datasheet.ciiva.com/16893/dcrcw-16893414.pdf?src-supplier=Avnet+Europe; ComponentLink12Description: https://datasheet.ciiva.com/16893/dcrcw-16893414.pdf?src-supplier=Avnet+Europe; ComponentLink13URL: https://datasheet.ciiva.com/26316/fld-crcw-e3-data-en-26316542.pdf?src-supplier=Distrelec; ComponentLink13Description: https://datasheet.ciiva.com/26316/fld-crcw-e3-data-en-26316542.pdf?src-supplier=Distrelec
R2 R3 = Res3: VISHAY - CRCW060333R0FKEA. - Resistore su Chip a Mont. Superficiale, Film Spesso, 0603 [1608 Metrico], 33 ohm, Serie CRCW, 75 V; SPN: 541-2782-1-ND; Resistance: 33R; Tolerance: 1%; Temperature Coefficient: 100ppm/°C; Power Rating: 100mW; Voltage Rating: 75V; Published: 8-Jun-2000; LatestRevisionDate: 29-May-2009; LatestRevisionNote: IPC-7351 Footprint Added.; PackageReference: J1-0603; Publisher: Altium Limited; PackageDescription: Chip Resistor; Supplier 1: Digi-Key; Manufacturer: Vishay; Manufacturer Part Number: CRCW060333R0FKEA; RoHS: Yes; Category: Chip SMD Resistors; Stock 1: 59910; Pricing 1: 1=0.10000, 10=0.03300, 100=0.01340, 1000=0.00602, 2500=0.00522 (USD); Mount: Surface Mount; Case/Package: 0603; Weight: 7.1E-05oz; Case Code (Imperial): 0603; Case Code (Metric): 1608; Contact Plating: Tin; Min Operating Temperature: -55°C; Max Operating Temperature: 155°C; Composition: Thick Film; Packaging: Tape and Reel; Number of Terminations: 2; Max Power Dissipation: 100mW; Voltage Rating (DC): 75V; Package Quantity: 10; Military Standard: Not; Termination: SMD/SMT; Features: Automotive AEC-Q200; Length: 1.55mm; Height: 0.45mm; Width: 0.85mm; Depth: 0.85mm; Radiation Hardening: No; Lead Free: Lead Free; REACH SVHC: Unknown; ComponentLink1URL: https://datasheet.ciiva.com/11809/0900766b80d98afc-11809158.pdf?src-supplier=RSComponents; ComponentLink1Description: https://datasheet.ciiva.com/11809/0900766b80d98afc-11809158.pdf?src-supplier=RSComponents; ComponentLink2URL: https://datasheet.ciiva.com/7777/1697337-7777317.pdf?src-supplier=Element14; ComponentLink2Description: https://datasheet.ciiva.com/7777/1697337-7777317.pdf?src-supplier=Element14; ComponentLink3URL: https://datasheet.ciiva.com/7777/1720486-7777557.pdf?src-supplier=Element14; ComponentLink3Description: https://datasheet.ciiva.com/7777/1720486-7777557.pdf?src-supplier=Element14; ComponentLink4URL: https://datasheet.ciiva.com/16783/70201119-16783349.pdf?src-supplier=Allied+Electronics; ComponentLink4Description: https://datasheet.ciiva.com/16783/70201119-16783349.pdf?src-supplier=Allied+Electronics; ComponentLink5URL: https://datasheet.ciiva.com/7777/1720486-7777558.pdf?src-supplier=Element14; ComponentLink5Description: https://datasheet.ciiva.com/7777/1720486-7777558.pdf?src-supplier=Element14; ComponentLink6URL: https://datasheet.ciiva.com/16771/70201119-16771126.pdf?src-supplier=Allied+Electronics; ComponentLink6Description: https://datasheet.ciiva.com/16771/70201119-16771126.pdf?src-supplier=Allied+Electronics; ComponentLink7URL: https://datasheet.ciiva.com/2465/dcrcwe3-2465591.pdf?src-supplier=Digi-Key; ComponentLink7Description: https://datasheet.ciiva.com/2465/dcrcwe3-2465591.pdf?src-supplier=Digi-Key; ComponentLink8URL: https://datasheet.ciiva.com/2465/dcrcwe3-2465592.pdf?src-supplier=Digi-Key; ComponentLink8Description: https://datasheet.ciiva.com/2465/dcrcwe3-2465592.pdf?src-supplier=Digi-Key; ComponentLink9URL: https://datasheet.ciiva.com/2465/dcrcwe3-2465593.pdf?src-supplier=Digi-Key; ComponentLink9Description: https://datasheet.ciiva.com/2465/dcrcwe3-2465593.pdf?src-supplier=Digi-Key; ComponentLink10URL: https://datasheet.ciiva.com/16893/dcrcwe3-16893242.pdf?src-supplier=Avnet+Europe; ComponentLink10Description: https://datasheet.ciiva.com/16893/dcrcwe3-16893242.pdf?src-supplier=Avnet+Europe
S1 = SS312SAH4-R: Switch Slide ON None ON SPDT Side Slide 0.1A 28VAC 28VDC 0.4VA 10000Cycles Gull Wing SMD T/R; MF: NKK Switches; Package: None; MP: SS312SAH4-R; SnapEDA_Link: https://www.snapeda.com/parts/SS312SAH4-R/NKK%20Switches/view-part/?ref=snap; Price: None; Availability: Unavailable; Value: *
SW1 = SW-PB: Switch; Published: 24-Mar-1999; LatestRevisionDate: 17-Jul-2002; LatestRevisionNote: Re-released for DXP Platform.; PackageReference: SPST-2; Publisher: Altium Limited; PackageDescription: Switch; 2 Leads
U2#1 = MKL02Z32VFG4: No Description Available; Vendor: NXP; CPU: ARM Cortex-M0+; Max_Frequency: 48; Flash_KB: 32; SRAM_KB: 4; Pin_Count: 16; Manufacturer_Part_Number: MKL02Z32VFG4; Package: QFN; Copyright: Copyright (C) 2016 Accelerated Designs. All rights reserved; RefDes: RefDes; Type: DEV; Value: Value; ComponentLink1Description: Order from here; ComponentLink1URL: https://www.pjrc.com/store/ic_mkl02.html
U2#2 = LP38691SDX-3.3/N: No Description Available; Vendor: Texas Instruments; Built_By: EMA_UL_Team; Manufacturer_Part_Number: LP38691SDX-3.3/NOPB; Copyright: Copyright (C) 2018 Accelerated Designs. All rights reserved; RefDes: RefDes; Type: DEV; Value: Value